# Altium schematic sheet SensorBoardSchematic.SchDoc
size A4
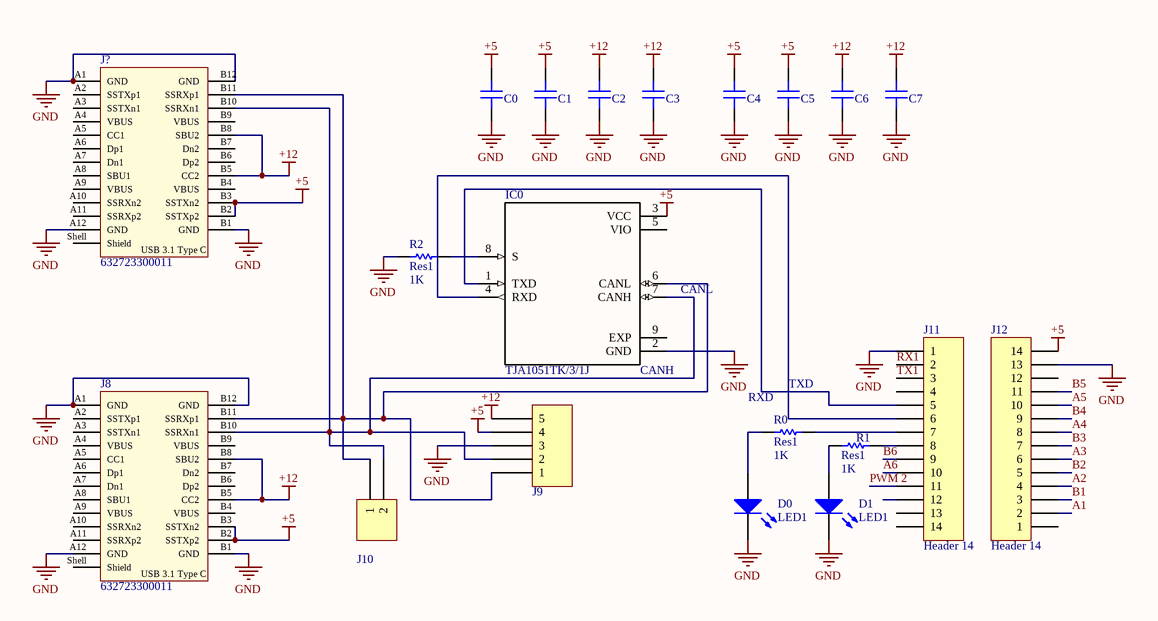
[diagram p0: SensorBoardSchematic.SchDoc]

## Parts
C0  0.1uF  [CAP 0402/1005]  (value not drawn)
C1  0.1uF  [CAP 0402/1005]  (value not drawn)
C2  0.1uF  [CAP 0402/1005]  (value not drawn)
C3  0.1uF  [CAP 0402/1005]  (value not drawn)
C4  4.7uF  [CAP 1206/3216 - 1.8MM]  (value not drawn)
C5  4.7uF  [CAP 1206/3216 - 1.8MM]  (value not drawn)
C6  4.7uF  [CAP 1206/3216 - 1.8MM]  (value not drawn)
C7  4.7uF  [CAP 1206/3216 - 1.8MM]  (value not drawn)
D0  LED1  [LED-1]
D1  LED1  [LED-1]
IC0  TJA1051TK/3/1J  [SON65P300X300X95-8N]
J8  632723300011  [632723300011]
J9  282834-5  [TE 282834-5]  (value not drawn)
J10  282834-2  [TE 282834-2]  (value not drawn)
J11  Header 14  [HDR1X14]
J12  Header 14  [HDR1X14]
J?  632723300011  [632723300011]
R0  Res1  value 1K  [AXIAL-0.3]
R1  Res1  value 1K  [AXIAL-0.3]
R2  Res1  value 1K  [AXIAL-0.3]

## Nets
+5: C0.2 C1.2 C4.2 C5.2 IC0.3(VCC) J8.B2(SSTXp2) J8.B3(SSTXn2) J9.4 J12.14 J?.B2(SSTXp2) J?.B3(SSTXn2)
+12: C2.2 C3.2 C6.2 C7.2 J8.B5(CC2) J8.B8(SBU2) J9.5 J?.B5(CC2) J?.B8(SBU2)
GND: C0.1 C1.1 C2.1 C3.1 C4.1 C5.1 C6.1 C7.1 D0.2(K) D1.2(K) IC0.2(GND) J8.A1(GND) J8.A12(GND) J8.B1(GND) J8.B12(GND) J9.3 J11.1 J12.13 J?.A1(GND) J?.A12(GND) J?.B1(GND) J?.B12(GND) R2.2
A1: J12.2
A2: J12.4
A3: J12.6
A4: J12.8
A5: J12.10
A6: J11.10
B1: J12.3
B2: J12.5
B3: J12.7
B4: J12.9
B5: J12.11
B6: J11.9
PWM 2: J11.11
RX1: J11.2
TX1: J11.3
NetD0_1: D0.1(A) R0.2
NetD1_1: D1.1(A) R1.2
NetIC0_1: IC0.1(TXD) J11.5
NetIC0_4: IC0.4(RXD) J11.6
NetIC0_6: IC0.6(CANL) J8.B11(SSRXp1) J9.1 J10.1 J?.B11(SSRXp1)
NetIC0_7: IC0.7(CANH) J8.B10(SSRXn1) J9.2 J10.2 J?.B10(SSRXn1)
NetIC0_8: IC0.8(S) R2.1
NetJ11_7: J11.7 R0.1
NetJ11_8: J11.8 R1.1

Not connected (* = marked no-connect by the designer): IC0 5(VIO) 9(EXP); J8 A2(SSTXp1) A3(SSTXn1) A4(VBUS) A5(CC1) A6(Dp1) A7(Dn1) A8(SBU1) A9(VBUS) A10(SSRXn2) A11(SSRXp2) B4(VBUS) B6(Dp2) B7(Dn2) B9(VBUS) Shell(Shield); J11 4 12 13 14; J12 1 12; J? A2(SSTXp1) A3(SSTXn1) A4(VBUS) A5(CC1) A6(Dp1) A7(Dn1) A8(SBU1) A9(VBUS) A10(SSRXn2) A11(SSRXp2) B4(VBUS) B6(Dp2) B7(Dn2) B9(VBUS) Shell(Shield)

## Notes on the sheet
- (near IC0) CANL
- (near IC0) CANH
- TXD
- (near R0) RXD
- (in symbol 632723300011) USB 3.1 Type C

## Library data of the parts
C0-C3 = C1005X7R1V104K050BB: CAP CER 0.1UF 35V X7R 0402; Manufacturer: TDK Corporation; TemperatureRange: -55C ~ 125C; Tolerance: 10%; Value: 0.1uF; Part Number: C1005X7R1V104K050BB; PartId: 3862; Supplier 1: Digi-Key; Supplier Part Number 1: 445-7344-2-ND; ComponentLink1Description: Datasheet; ComponentLink1URL: https://product.tdk.com/info/en/catalog/datasheets/mlcc_commercial_general_en.pdf; ComponentLink2Description: Digi-Key listing; ComponentLink2URL: http://digikey.com/product-detail/en/C1005X7R1V104K050BB/445-7344-2-ND/2732779; TemperatureCoefficient: X7R; Voltage: 35V; Price: 0.0287; Type: -; Device Package: 0402 (1005 Metric)
C4-C7 = 160R18X475KV4E: CAP CER 4.7UF 16V X5R 1206; Manufacturer: Johanson Dielectrics Inc.; TemperatureRange: -55C ~ 85C; Tolerance: 10%; Value: 4.7uF; Part Number: 160R18X475KV4E; PartId: 17939; Supplier 1: Digi-Key; Supplier Part Number 1: 709-1234-2-ND; ComponentLink1Description: Datasheet; ComponentLink1URL: http://www.johansondielectrics.com/downloads/JDI-Tanceram.pdf; ComponentLink2Description: Digi-Key Listing; ComponentLink2URL: https://www.digikey.com/product-detail/en/johanson-dielectrics-inc/160R18X475KV4E/709-1234-2-ND/2074906; TemperatureCoefficient: X5R; Voltage: 16V; Price: 0.1462; Device Package: 1206 (3216 Metric)
D0 D1 = LED1: Typical RED GaAs LED; Published: 8-Jun-2000; LatestRevisionDate: 08-Jul-2005; LatestRevisionNote: Mech Layer 1 removed.; PackageReference: LED-1; Publisher: Altium Limited; PackageDescription: LED; 2 Leads
IC0 = TJA1051TK/3/1J: TJA1051 Single 5 V 1 MBd Surface Mount High Speed CAN Transceiver - HVSON-8; MF: NXP USA; SnapEDA_Link: https://www.snapeda.com/parts/TJA1051TK/3/1J/NXP%20USA%20Inc./view-part/?ref=snap; Price: None; MP: TJA1051TK/3/1J; Availability: Unavailable; Package: VDFN-8 NXP Semiconductors; Value: *
J8 J? = 632723300011: USB 3.1 Type C Receptacle Horizontal THR WR-COM; Interface Type: Type C; Sub-Family: USB 3.1; ComponentLink1Description: Manufacturer; ComponentLink1URL: http://www.we-online.de; ComponentLink2Description: Datasheet; ComponentLink2URL: http://katalog.we-online.de/em/datasheet/632723x00011.pdf; Part Number: 632723300011; Published Date: April 2017; Publisher: Wurth Elektronik; Gender: Receptacle; Type: Horizontal; Construction: THR
J9 = 282834-5: TERM BLOCK 5POS SIDE ENT 2.54MM; Manufacturer: TE Connectivity AMP Connectors; TemperatureRange: -40C ~ 105C; Voltage: 150V; Pitch: 0.100" (2.54mm); Number Of Levels: 1; Positions Per Level: 5; PartId: 9292; Part Number: 282834-5; Supplier 1: Digi-Key; Supplier Part Number 1: A98336-ND; ComponentLink1Description: Datasheet; ComponentLink1URL: http://www.te.com/commerce/DocumentDelivery/DDEController?Action=srchrtrv&DocNm=282834&DocType=Customer+Drawing&DocLang=English; ComponentLink2Description: Digi-Key Listing; ComponentLink2URL: http://www.digikey.ca/product-detail/en/282834-5/A98336-ND/1153266; Price: 3.99; Colour: Green; Orientation: Horizontal with Board
J10 = 282834-2: TERM BLOCK 2POS SIDE ENT 2.54MM; Manufacturer: TE Connectivity AMP Connectors; TemperatureRange: -40C ~ 105C; Voltage: 150V; Pitch: 0.100" (2.54mm); Number Of Levels: 1; Positions Per Level: 2; PartId: 9289; Part Number: 282834-2; Supplier 1: Digi-Key; Supplier Part Number 1: A98333-ND; ComponentLink1Description: Datasheet; ComponentLink1URL: http://www.te.com/commerce/DocumentDelivery/DDEController?Action=srchrtrv&DocNm=282834&DocType=Customer+Drawing&DocLang=English; ComponentLink2Description: Digi-Key Listing; ComponentLink2URL: http://www.digikey.ca/product-detail/en/282834-2/A98333-ND/1150135; Price: 1.3; Colour: Green; Orientation: Horizontal with Board
J11 J12 = Header 14: Header, 14-Pin; LatestRevisionDate: 17-Jul-2002; LatestRevisionNote: Re-released for DXP Platform.; Publisher: Altium Limited
R0-R2 = Res1: Resistor; Published: 8-Jun-2000; LatestRevisionDate: 17-Jul-2002; LatestRevisionNote: Re-released for DXP Platform.; PackageReference: AXIAL-0.3; Publisher: Altium Limited; PackageDescription: Axial Device, Thru-Hole; 2 Leads; 0.3 in Pin Spacing